# Altium schematic sheet Camera.SchDoc: Camera
size A3; Author: Vi Tín; SheetNumber: 7; SheetTotal: 15
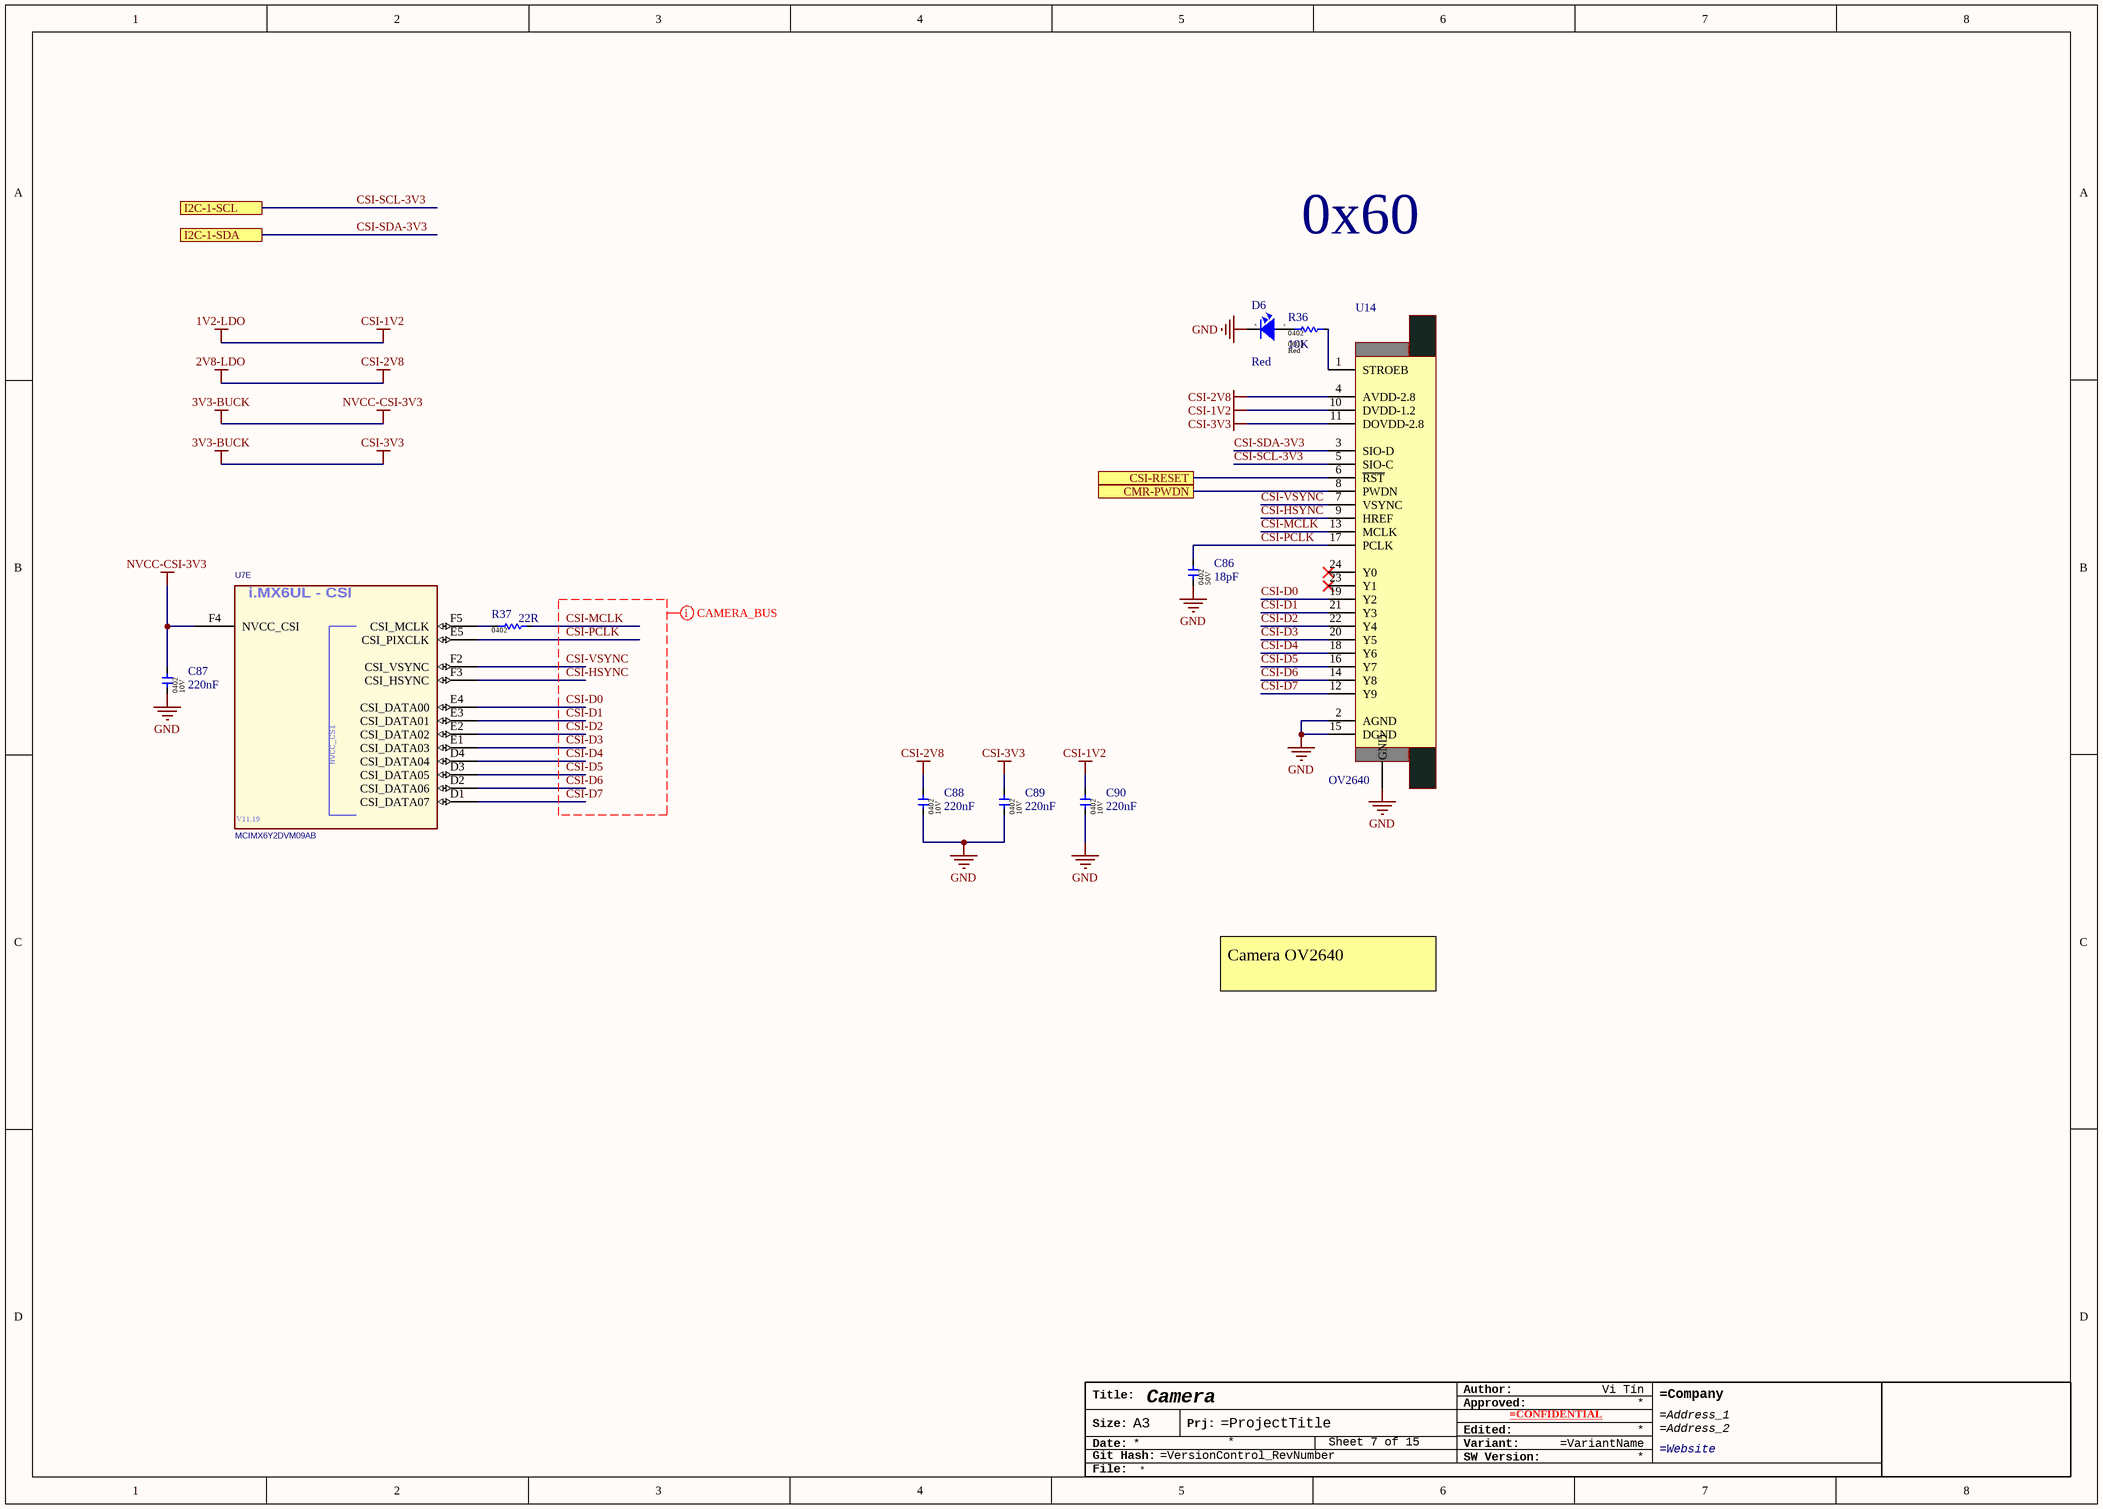
[diagram p0: Camera.SchDoc]

## Parts
*?  TitleBlock_Generic  (value not drawn)  (graphical)
C86  18pF  [CAP-0402]
C87  220nF  [CAP-0402]
C88  220nF  [CAP-0402]
C89  220nF  [CAP-0402]
C90  220nF  [CAP-0402]
D6  Red  [LED-0603 RED]
R36  10K  [RES-0402]
R37  22R  [RES-0402]
U7  MCIMX6Y2DVM09AB  [IMX6ULL]  (part E of 11)
U14  OV2640  [FPC - 24P, 0.5MM, bot]

## Ports
CMR-PWDN, CSI-RESET, I2C-1-SCL, I2C-1-SDA

## Nets
1V2-LDO: C90.2 U14.10(DVDD-1.2)  [also labelled CSI-1V2]
2V8-LDO: C88.2 U14.4(AVDD-2.8)  [also labelled CSI-2V8]
3V3-BUCK: C87.2 C89.2 U7.F4(NVCC_CSI) U14.11(DOVDD-2.8)  [also labelled CSI-3V3, NVCC-CSI-3V3]
GND: C86.1 C87.1 C88.1 C89.1 C90.1 D6.1(Cathode) U14.0(GND) U14.2(AGND) U14.15(DGND)
CMR-PWDN: U14.8(PWDN) ; port CMR-PWDN
CSI-D0: U7.E4(CSI_DATA00) U14.19(Y2)
CSI-D1: U7.E3(CSI_DATA01) U14.21(Y3)
CSI-D2: U7.E2(CSI_DATA02) U14.22(Y4)
CSI-D3: U7.E1(CSI_DATA03) U14.20(Y5)
CSI-D4: U7.D4(CSI_DATA04) U14.18(Y6)
CSI-D5: U7.D3(CSI_DATA05) U14.16(Y7)
CSI-D6: U7.D2(CSI_DATA06) U14.14(Y8)
CSI-D7: U7.D1(CSI_DATA07) U14.12(Y9)
CSI-HSYNC: U7.F3(CSI_HSYNC) U14.9(HREF)
CSI-MCLK: R37.2 U14.13(MCLK)
CSI-PCLK: C86.2 U7.E5(CSI_PIXCLK) U14.17(PCLK)
CSI-RESET: U14.6(~{RST}) ; port CSI-RESET
CSI-SCL-3V3: U14.5(SIO-C) ; port I2C-1-SCL
CSI-SDA-3V3: U14.3(SIO-D) ; port I2C-1-SDA
CSI-VSYNC: U7.F2(CSI_VSYNC) U14.7(VSYNC)
NetD6_2: D6.2(Anode) R36.1
NetR36_2: R36.2 U14.1(STROEB)
NetR37_1: R37.1 U7.F5(CSI_MCLK)

Not connected (* = marked no-connect by the designer): U14 23(Y1)* 24(Y0)*

## Layout directives
net class CAMERA_BUS: CSI-D0, CSI-D1, CSI-D2, CSI-D3, CSI-D4, CSI-D5, CSI-D6, CSI-D7, CSI-HSYNC, CSI-MCLK, CSI-PCLK, CSI-VSYNC

## Notes on the sheet
- 0x60
- Camera OV2640
- (in symbol 19-217/R6C-AL1M2VY/3T) K; A
- (in symbol MCIMX6Y2DVM09AB, part E) i.MX6UL - CSI; V11.19
- (in symbol TitleBlock_Generic) Author:; Title:; Approved:; Size:; A3; Prj:; Edited:; Date:; Variant:; SW Version:; Git Hash:; File:

## Library data of the parts
C86 = 0402N180J500CT: 18pF ±5% 50V NP0 0402 Multilayer Ceramic Capacitors MLCC - SMD/SMT RoHS; Manufacture: WALSIN; Package / Case: 0402; Component type: Capacitor; Manufacture part: 0402N180J500CT; Capacitor value: 18pF; Voltage: 50V; Package: 0402
C87-C90 = 0402X224J100CT: 220nF ±5% 10V X5R 0402 Multilayer Ceramic Capacitors MLCC - SMD/SMT RoHS; Manufacture: WALSIN; Package / Case: 0402; Component type: Capacitor; Manufacture part: 0402X224J100CT; Capacitor value: 220nF; Voltage: 10V; Package: 0402
D6 = 19-217/R6C-AL1M2VY/3T: Red 617.5~633.5nm 0603 Light Emitting Diodes (LED) RoHS; Manufacture: Everlight Elec; Package / Case: 0402; Component type: Led; Part reference: *; Manufacture part: 19-217/R6C-AL1M2VY/3T; Color: Red; Package: 0603
R36 = WR04X1002FTL: 10kΩ ±1% 1/16W ±100ppm/℃ 0402 Chip Resistor - Surface Mount RoHS; Manufacture: WALSIN; Package / Case: 0201; Component type: Resistor; Manufacture part: WR04X1002FTL; Resistor value: 10K; Package: 0402
R37 = WR04X22R0FTL: 22Ω ±1% 1/16W ±100ppm/℃ 0402 Chip Resistor - Surface Mount RoHS; Manufacture: WALSIN; Package / Case: 0201; Component type: Resistor; Manufacture part: WR04X22R0FTL; Resistor value: 22R; Package: 0402
U7 = MCIMX6Y2DVM09AB: Microprocessors - MPU i.MX 32-bit MPU ARM -A7 900MHz, 0.8mm Pitch; Manufacture: NXP Semiconductors; CLASS: IC; CAD_APPROVED: Yes; PRE_APN: 330-76997; MFG_PN01: PCIMX6G3CVM05AA; MFG_NAME01: FREESCALE SEMICONDUCTOR; AGILE_PN: TMP-WF-23753; HEIGHT: 1.37 MM; ROHS: Yes; Manufacture part: MCIMX6Y2DVM09AB; Package: MAPBGA-289 (14x14); Datasheet: https://www.mouser.vn/datasheet/2/302/IMX6ULLCEC-1126331.pdf
U14 = OV2640: Color CMOS UXGA (2.0 MegaPixel); Manufacture: Omnivision; Manufacture part: OV2640; Type: Camera; Datasheet: https://www.uctronics.com/download/OV2640_DS.pdf
*? = TitleBlock_Generic: Manufacture part: TitleBlock_Generic; Manufacture: N/A; Type: Graphic